# EAGLE schematic CommsTransceiverSupply (EAGLE 7.7.0)
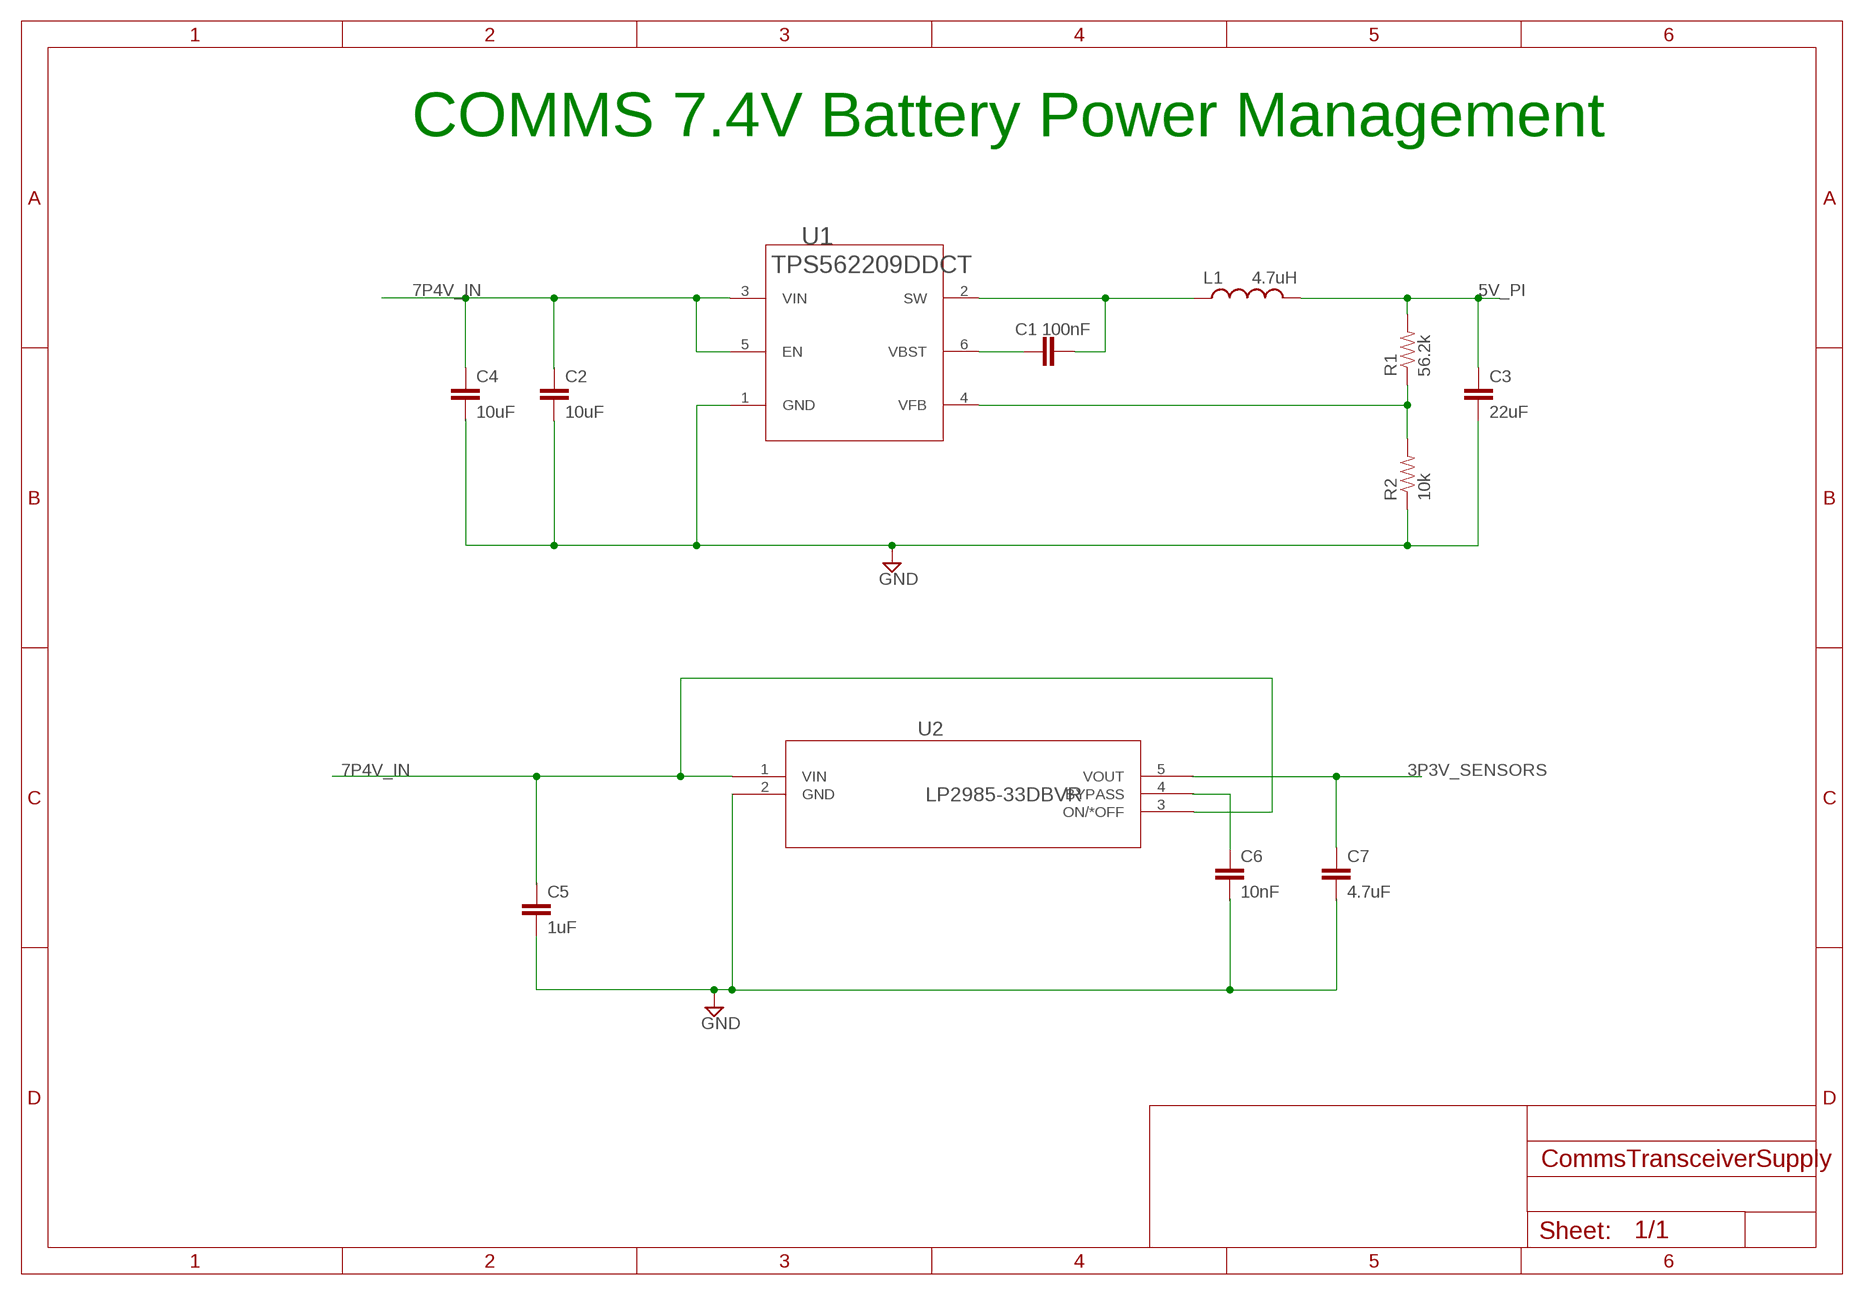
[diagram p0: schematic, sheet 1]

## Parts
C1  100nF  CAP_100NF0_0805  [C0805]
C2  10uF  CAP_10UF0_0805  [C0805]
C3  22uF  CAP_22UF0_1206  [C1206]
C4  10uF  CAP_10UF0_0805  [C0805]
C5  1uF  CAP_1UF0_0603  [C0603]
C6  10nF  CAP_10NF0_0805  [C0805]
C7  4.7uF  CAP_4UH7_0603  [C0603]
L1  4.7uH  L_4UH7  [SRN6045-4R7Y]
R1  56.2k  RES_56R2_0603  [R0603]
R2  10k  RES_10R0_0603  [R0603]
U1  TPS562209DDCT  TPS562209DDCR  [DDC0006A]
U2  LP2985-33DBVR  LP2985-33_DBV_5  [DBV5]

## Nets
3P3V_SENSORS: C7.1 U2.5(VOUT)
5V_PI: C3.1 L1.2 R1.2
7P4V_IN: C2.1 C4.1 C5.1 U1.3(VIN) U1.5(EN) U2.1(VIN) U2.3(ON/*OFF)
GND: C2.2 C3.2 C4.2 C5.2 C6.2 C7.2 R2.1 U1.1(GND) U2.2(GND)
N$1: U1.6(VBST)
N$2: C1.2 L1.1 U1.2(SW)
N$3: R1.1 R2.2 U1.4(VFB)
N$4: C6.1 U2.4(BYPASS)
Unconnected: C1.1

## Notes on the sheet
- COMMS 7.4V Battery Power Management

## Library data of the parts
C1 = comms:CAP: Chip Capacitor; MANUFACTURER: AVX Corporation; MANUFACTURER_PN: 08053C104KAT2A; TEMP_COEFF: X7R; TOLERANCE: 10%; VENDOR: Digi-Key; VENDOR_PN: 478-3755-1-ND; VOLTAGE: 25V
C2 C4 = comms:CAP: Chip Capacitor; MANUFACTURER: Murata Electronics North America; MANUFACTURER_PN: GRM21BR61C106KE15L; TEMP_COEFF: X5R; TOLERANCE: 10%; VENDOR: Digi-Key; VENDOR_PN: 490-3886-1-ND; VOLTAGE: 16V
C3 = comms:CAP: Chip Capacitor; MANUFACTURER: Murata Electronics North America; MANUFACTURER_PN: GRM31CR61A226ME19L; TEMP_COEFF: X5R; TOLERANCE: 20%; VENDOR: Digi-Key; VENDOR_PN: 490-4738-1-ND; VOLTAGE: 10V
C5 = comms:CAP: Chip Capacitor; MANUFACTURER: Murata; MANUFACTURER_PN: GRM188R61C105KA93D; TEMP_COEFF: X5R; TOLERANCE: 10%; VENDOR: Digi-Key; VENDOR_PN: 490-1536-1-ND; VOLTAGE: 16V
C6 = comms:CAP: Chip Capacitor; MANUFACTURER: Kemet; MANUFACTURER_PN: C0805C103K5RACTU; TEMP_COEFF: X7R; TOLERANCE: 10%; VENDOR: Digi-Key; VENDOR_PN: 399-1158-1-ND; VOLTAGE: 50V
C7 = comms:CAP: Chip Capacitor; MANUFACTURER: Murata; MANUFACTURER_PN: GRM188R60J475KE19D; TEMP_COEFF: X5R; TOLERANCE: 10%; VENDOR: Digi-Key; VENDOR_PN: 490-3297-1-ND; VOLTAGE: 6.3V
L1 = comms:L: Surface Mount Inductor; CURRENT_DC: 3A; CURRENT_SAT: 4A; DCR_MAX: 37.6mOHM; MANUFACTURER: Bourns Inc.; MANUFACTURER_PN: SRN6045-4R7Y; SHIELDED: Yes; TOLERANCE: 30%; TYPE: Wirewound; VENDOR: Digi-Key; VENDOR_PN: SRN6045-4R7YCT-ND
R1 = comms:RES: Chip Resistor; MANUFACTURER: Panasonic; MANUFACTURER_PN: ERJ-3EKF5622V; POWER: 1/10W; TOLERANCE: 1%; VENDOR: Digi-key; VENDOR_PN: P56.2KHCT-ND
R2 = comms:RES: Chip Resistor; MANUFACTURER: Panasonic; MANUFACTURER_PN: ERJ-3EKF1002V; POWER: 1/10W; TOLERANCE: 1%; VENDOR: Digi-key; VENDOR_PN: P10.0KHCT-ND
U1 = comms:TPS562209: Buck Switching Regulator IC Positive Adjustable 0.765V 1 Output 2A SOT-23-6 Thin, TSOT-23-6; MANUFACTURER: Texas Instruments; MANUFACTURER_PN: TPS562209DDCT; VENDOR: Digi-Key; VENDOR_PN: 296-37302-1-ND
U2 = comms:LP2985-33: Linear Voltage Regulator IC Positive Fixed 1 Output 3.3V 150mA SOT-23-5; MANUFACTURER: Texas Instruments; MANUFACTURER_PN: LP2985-33DBVR; VENDOR: Digi-Key; VENDOR_PN: 296-18476-1-ND